# Altium schematic sheet Connectors.SchDoc
size A4
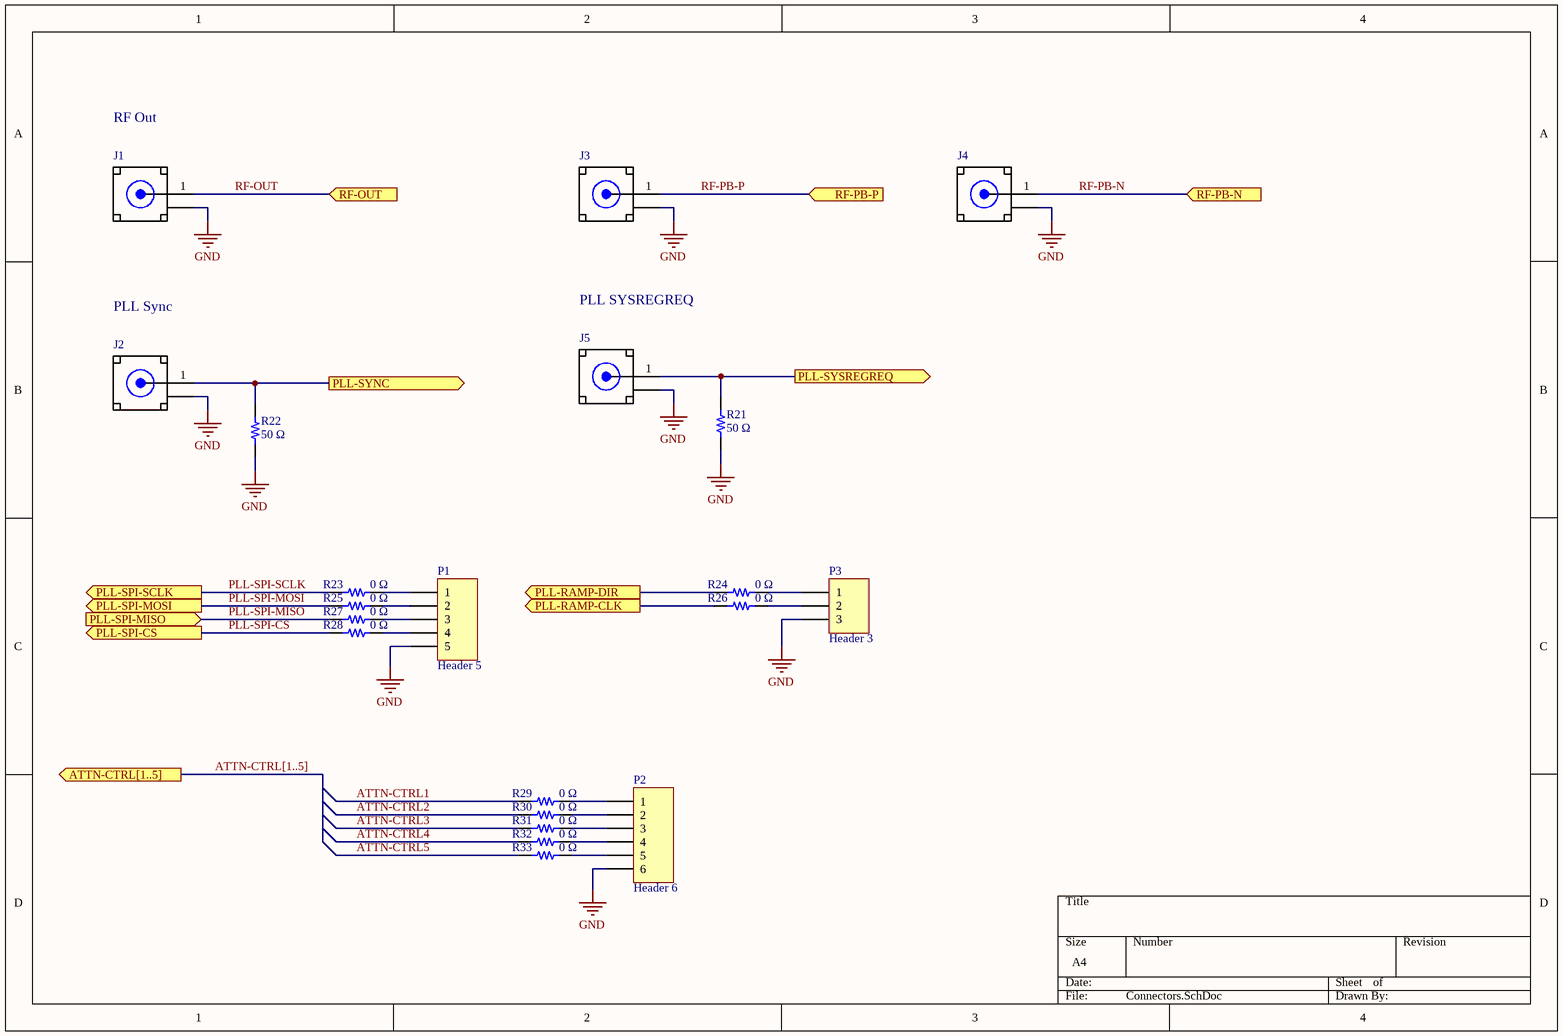
[diagram p0: Connectors.SchDoc]

## Parts
J1  SMA-J-P-H-ST-EM1  [SAMTEC SMA-J-P-H-ST-EM1]  (value not drawn)
J2  SMA-J-P-H-ST-EM1  [SAMTEC SMA-J-P-H-ST-EM1]  (value not drawn)
J3  SMA-J-P-H-ST-EM1  [SAMTEC SMA-J-P-H-ST-EM1]  (value not drawn)
J4  SMA-J-P-H-ST-EM1  [SAMTEC SMA-J-P-H-ST-EM1]  (value not drawn)
J5  SMA-J-P-H-ST-EM1  [SAMTEC SMA-J-P-H-ST-EM1]  (value not drawn)
P1  Header 5  [HDR1X5]
P2  Header 6  [HDR1X6]
P3  Header 3  [HDR1X3]
R21  50 Ω  [RES 0603_1608]
R22  50 Ω  [RES 0603_1608]
R23  0 Ω  [RES 0402_1005]
R24  0 Ω  [RES 0402_1005]
R25  0 Ω  [RES 0402_1005]
R26  0 Ω  [RES 0402_1005]
R27  0 Ω  [RES 0402_1005]
R28  0 Ω  [RES 0402_1005]
R29  0 Ω  [RES 0402_1005]
R30  0 Ω  [RES 0402_1005]
R31  0 Ω  [RES 0402_1005]
R32  0 Ω  [RES 0402_1005]
R33  0 Ω  [RES 0402_1005]

## Ports
ATTN-CTRL[1..5] (out), PLL-RAMP-CLK (out), PLL-RAMP-DIR (out), PLL-SPI-CS (out), PLL-SPI-MISO (in), PLL-SPI-MOSI (out), PLL-SPI-SCLK (out), PLL-SYNC (out), PLL-SYSREGREQ (out), RF-OUT (in), RF-PB-N (in), RF-PB-P (in)

## Nets
GND: J1.2(GND) J2.2(GND) J3.2(GND) J4.2(GND) J5.2(GND) P1.5 P2.6 P3.3 R21.2 R22.2
ATTN-CTRL1: R29.1
ATTN-CTRL2: R30.1
ATTN-CTRL3: R31.1
ATTN-CTRL4: R32.1
ATTN-CTRL5: R33.1
PLL-RAMP-CLK: R26.1 ; port PLL-RAMP-CLK
PLL-RAMP-DIR: R24.1 ; port PLL-RAMP-DIR
PLL-SPI-CS: R28.1 ; port PLL-SPI-CS
PLL-SPI-MISO: R27.1 ; port PLL-SPI-MISO
PLL-SPI-MOSI: R25.1 ; port PLL-SPI-MOSI
PLL-SPI-SCLK: R23.1 ; port PLL-SPI-SCLK
PLL-SYNC: J2.1(SIGNAL) R22.1 ; port PLL-SYNC
PLL-SYSREGREQ: J5.1(SIGNAL) R21.1 ; port PLL-SYSREGREQ
RF-OUT: J1.1(SIGNAL) ; port RF-OUT
RF-PB-N: J4.1(SIGNAL) ; port RF-PB-N
RF-PB-P: J3.1(SIGNAL) ; port RF-PB-P
NetP1_1: P1.1 R23.2
NetP1_2: P1.2 R25.2
NetP1_3: P1.3 R27.2
NetP1_4: P1.4 R28.2
NetP2_1: P2.1 R29.2
NetP2_2: P2.2 R30.2
NetP2_3: P2.3 R31.2
NetP2_4: P2.4 R32.2
NetP2_5: P2.5 R33.2
NetP3_1: P3.1 R24.2
NetP3_2: P3.2 R26.2

## Buses and harness runs
bus ATTN-CTRL[1..5] = port ATTN-CTRL[1..5]

## Notes on the sheet
- RF Out
- PLL Sync
- PLL SYSREGREQ

## Library data of the parts
J1-J5 = SMA-J-P-H-ST-EM1: CONN SMA JACK STR 50OHM EDGE MNT; Manufacturer: Samtec Inc.; Frequency - Max: 20GHz; Number of Ports: 1; Body Material: Brass; Body Finish: Gold; Dialetric Material: Polytetrafluoroethylene (PTFE); Center Contact Material: Beryllium Copper; Voltage Rating: 335V; Part Number: SMA-J-P-H-ST-EM1; ComponentLink1Description: Datasheet; ComponentLink1URL: http://suddendocs.samtec.com/catalog_english/sma.pdf; ComponentLink2Description: Drawing; ComponentLink2URL: http://suddendocs.samtec.com/prints/sma-j-p-x-st-em1-mkt.pdf; ComponentLink3Description: Digikey Link; ComponentLink3URL: https://www.digikey.com/products/en?keywords=SMA-J-P-H-ST-EM1; Device Package: Tray; Features: -; LastUpdated: 2020-03-11 6:05:05 AM; Lifecycle Status: Active; Minimum Order: 1; Operating Temperature: -65°C ~ 125°C; Packaging: Tray; Part Status: Active; Price: 4.33; Series: -; Supplier 1: DigiKey; Supplier Part Number 1: SAM8857-ND; Mounting Type: Board Edge, End Launch; Mounting Feature: -; Cable Group: -; Fastening Type: Threaded; Housing Color: Gold; Center Contact Plating: Gold; Mating Cycles: -; Insertion Loss: -; Connector Style: SMA
P1 = Header 5: Header, 5-Pin; LatestRevisionDate: 17-Jul-2002; LatestRevisionNote: Re-released for DXP Platform.; Publisher: Altium Limited
P2 = Header 6: Header, 6-Pin; LatestRevisionDate: 17-Jul-2002; LatestRevisionNote: Re-released for DXP Platform.; Publisher: Altium Limited
P3 = Header 3: Header, 3-Pin; LatestRevisionDate: 17-Jul-2002; LatestRevisionNote: Re-released for DXP Platform.; Publisher: Altium Limited
R21 R22 = RCP0603W50R0GEB: RES SMD 50 OHM 2% 1.5W 0603; Manufacturer: Vishay Dale; Temperature Coefficient: ±150ppm/°C; Value: 50 Ohms; Part Number: RCP0603W50R0GEB; ComponentLink1Description: Datasheet; ComponentLink1URL: http://www.vishay.com/docs/31098/rcp.pdf; ComponentLink2Description: DigiKey Link; ComponentLink2URL: http://digikey.com/product-detail/en/vishay-dale/RCP0603W50R0GEB/541-2655-1-ND/5481885; Composition: Thick Film; Device Package: 0603 (1608 Metric); Features: Moisture Resistant; Height - Seated (Max): 0.023" (0.58mm); LastUpdated: 2020-02-19 6:28:06 AM; Lifecycle Status: Active; Minimum Order: 1; Number of Terminations: 2; Operating Temperature: -65°C ~ 155°C; Package / Case: 0603 (1608 Metric); Packaging: TapeAndReel; Part Status: Active; Power (Watts): 1.5W; Price: 0.87; Resistance: 50 Ω; Series: RCP; Size / Dimension: 0.063" L x 0.032" W (1.60mm x 0.81mm); Supplier 1: DigiKey; Supplier Part Number 1: 541-2655-1-ND; Supplier Device Package: 0603; Tolerance: ±2%
R23-R33 = CR0402-J/-000GAS: RES 0 OHM JUMPER 1/16W 0402; Manufacturer: Bourns Inc.; Power (Watts): 0.063W, 1/16W; Value: 0 Ohms; Part Number: CR0402-J/-000GAS; ComponentLink1Description: Datasheet; ComponentLink1URL: https://www.bourns.com/docs/Product-Datasheets/CR0402-AS.pdf; ComponentLink2Description: DigiKey Link; ComponentLink2URL: http://digikey.com/product-detail/en/bourns-inc/CR0402-J-000GAS/CR0402-J-000GASCT-ND/6830113; Composition: Thick Film; Device Package: 0402 (1005 Metric); Features: Anti-Sulfur; Height - Seated (Max): 0.016" (0.40mm); LastUpdated: 2020-02-19 6:28:05 AM; Lifecycle Status: Active; Minimum Order: 1; Number of Terminations: 2; Operating Temperature: -55°C ~ 155°C; Package / Case: 0402 (1005 Metric); Packaging: TapeAndReel; Part Status: Active; Price: 0.01; Resistance: 0 Ω; Series: CR0402-AS; Size / Dimension: 0.039" L x 0.020" W (1.00mm x 0.50mm); Supplier 1: DigiKey; Supplier Part Number 1: CR0402-J/-000GASCT-ND; Supplier Device Package: 0402; Tolerance: Jumper